# EAGLE design moddeducurrent (EAGLE 6.2)
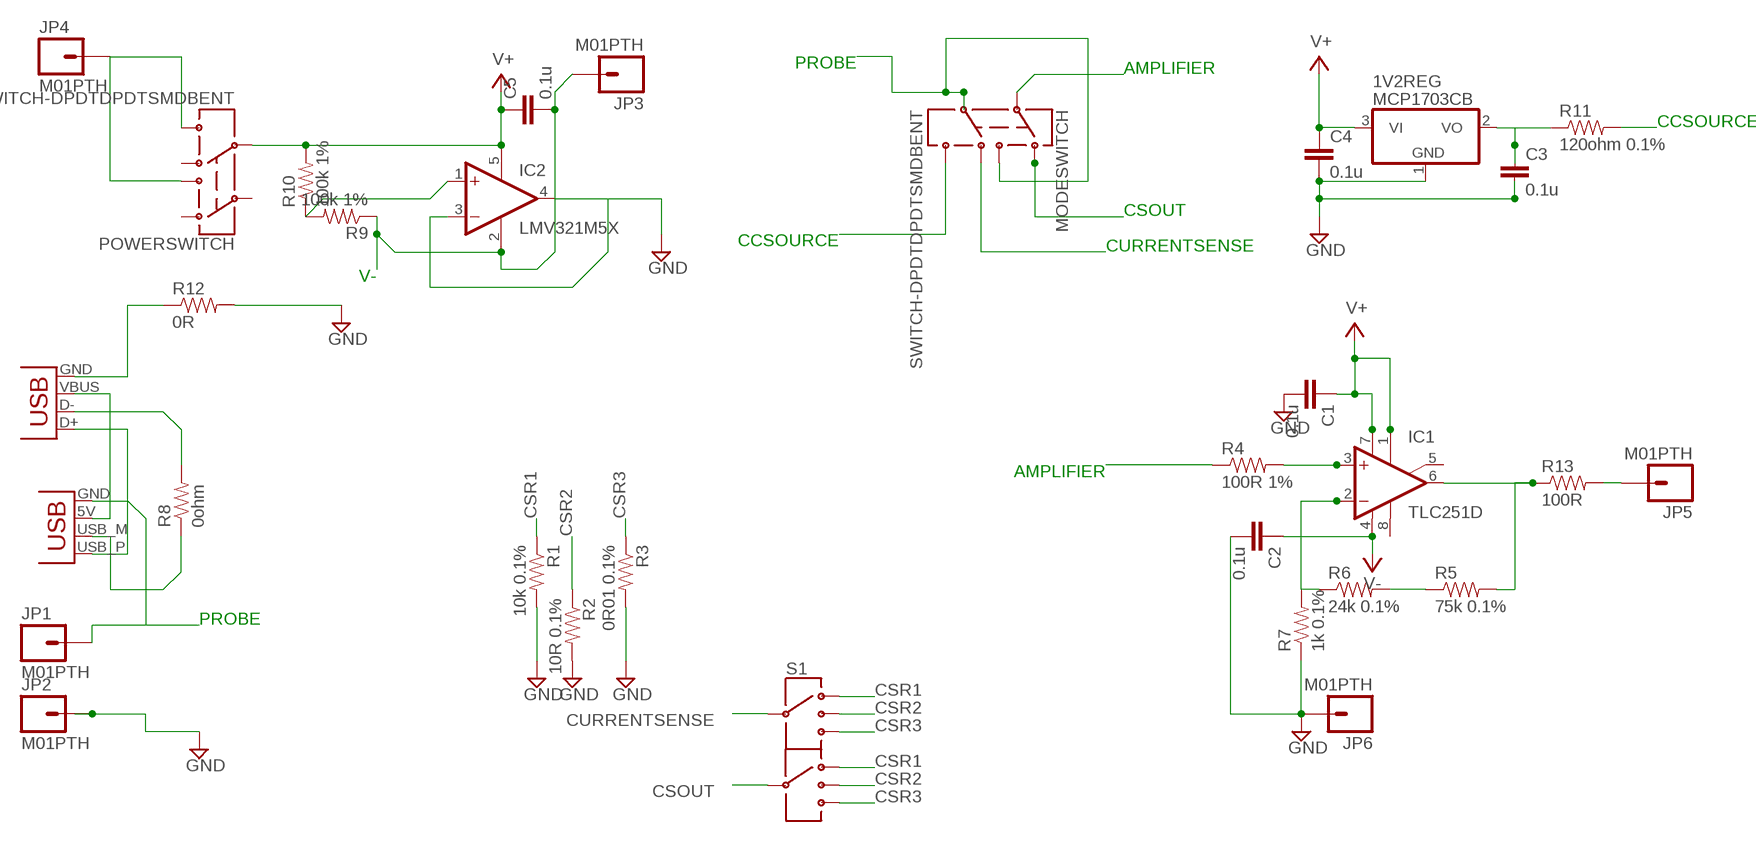
[diagram p0: schematic, sheet 1]

## Parts
1V2REG  MCP1703CB  [SOT23]
C1  0.1u  CAP0805  [0805]
C2  0.1u  CAP0805  [0805]
C3  0.1u  CAP0805  [0805]
C4  0.1u  CAP0805  [0805]
C5  0.1u  CAP0805  [0805]
IC1  TLC251D  [SO08]
IC2  LMV321M5X  [SOT23-5]
JP1  M01PTH  [1X01]
JP2  M01PTH  [1X01]
JP3  M01PTH  [1X01]
JP4  M01PTH  [1X01]
JP5  M01PTH  [1X01]
JP6  M01PTH  [1X01]
MODESWITCH  SWITCH-DPDTDPDTSMDBENT  [AYZ0202]
POWERSWITCH  SWITCH-DPDTDPDTSMDBENT  [AYZ0202]
R1  10k 0.1%  RESISTOR0805-RES  [0805]
R2  10R 0.1%  RESISTOR0805-RES  [0805]
R3  0R01 0.1%  RESISTOR0805-RES  [0805]
R4  100R 1%  RESISTOR0805-RES  [0805]
R5  75k 0.1%  RESISTOR0805-RES  [0805]
R6  24k 0.1%  RESISTOR0805-RES  [0805]
R7  1k 0.1%  RESISTOR0805-RES  [0805]
R8  0ohm  RESISTOR0805-RES  [0805]
R9  100k 1%  RESISTOR0805-RES  [0805]
R10  100k 1%  RESISTOR0805-RES  [0805]
R11  120ohm 0.1%  RESISTOR0805-RES  [0805]
R12  0R  RESISTOR0805-RES  [0805]
R13  100R  RESISTOR0805-RES  [0805]
S1  SWITCH-DP3T  [SWITCH-DP3T-SMD]
X1  USBPCB  [USB-A-PCB]
X2  USBOLD  [USB-MINIB-OLD]

## Nets
AMPIN: MODESWITCH.2 R4.1
CCSOURCE: MODESWITCH.6 R11.2
CSOUT: MODESWITCH.1 S1.BI
CSR1: R1.1 S1.A1 S1.B1
CSR2: R2.1 S1.A2 S1.B2
CSR3: R3.1 S1.A3 S1.B3
CURRENTSENSE: MODESWITCH.4 S1.AI
GND: 1V2REG.1(GND) C1.2 C2.2 C3.2 C4.2 IC2.3(-IN) IC2.4(OUT) JP2.1 JP6.1 R1.2 R2.2 R3.2 R7.1 R12.2
N$2: JP5.1 R13.2
N$4: 1V2REG.2(VO) C3.1 R11.1
N$6: R12.1 X2.GND
N$7: IC1.3(+IN) R4.2
N$8: R5.1 R6.2
N$9: IC1.2(-IN) R6.1 R7.2
N$11: R8.2 X2.D-
N$15: X1.USB_P(D+) X2.D+
N$16: R8.1 X1.USB_M(D-)
N$17: IC2.1(+IN) R9.2 R10.1
OUT: IC1.6(OUT) R5.2 R13.1
PROBE: JP1.1 MODESWITCH.3 MODESWITCH.5 X1.GND
V+: 1V2REG.3(VI) C1.1 C4.1 C5.1 IC1.1(ON1) IC1.7(V+) IC2.5(V+) POWERSWITCH.5 R10.2
V-: C2.1 C5.2 IC1.4(V-) IC2.2(V-) JP3.1 R9.1
VBAT: JP4.1 POWERSWITCH.3 POWERSWITCH.6
VUSB_EXTERN: X1.5V(VBUS) X2.VBUS
Unconnected: IC1.5(ON2) IC1.8(OPT) POWERSWITCH.1 POWERSWITCH.2 POWERSWITCH.4

## Notes on the sheet
- PROBE
- AMPLIFIER
- CCSOURCE
- CSOUT
- CCSOURCE
- CURRENTSENSE
- V-
- AMPLIFIER
- PROBE

## Library data of the parts
1V2REG = linear:MCP1703: 250 mA, 16V, Low Quiescent Current LDO Regulator Source: http://ww1.microchip.com/downloads/en/DeviceDoc/22049b.pdf
C1-C5 = SparkFun - Copy:CAP: Capacitor Standard 0603 ceramic capacitor, and 0.1" leaded capacitor.
IC1 = linear:TLC251: OP AMP
IC2 = linear:LMV321?*: General Purpose, Low Voltage, Rail-to-Rail Output Operational Amplifiers Source: http://www.national.com/mpf/LM/LMV321.html http://www.national.com/dt/lmv_qual.pdf
JP1-JP6 = SparkFun - Copy:M01: Header 1 Standard 1-pin 0.1" header. Use with straight break away headers (SKU : PRT-00116), right angle break away headers (PRT-00553), swiss pins (PRT-00743), machine pins (PRT-00117), and female headers (PRT-00115).
MODESWITCH POWERSWITCH = ebay:SWITCH-DPDT: DPDT Version of the COM-00597
R1-R13 = SparkFun - Copy:RESISTOR: Resistor Basic schematic elements and footprints for 0603, 1206, and PTH resistors.
S1 = LL:SWITCH-DP3T
X1 X2 = SparkFun - Copy:USB: USB Connectors USB-B-PTH is fully proven SKU : PRT-00139 USB-miniB is fully proven SKU : PRT-00587 USB-A-PCB is untested. USB-A-H is throughly reviewed, but untested. Spark Fun Electronics SKU : PRT-00437 USB-B-SMT is throughly reviewed, but untested. Needs silkscreen touching up. USB-A-S has not been used/tested USB-MB-H has not been used/tested

## Board
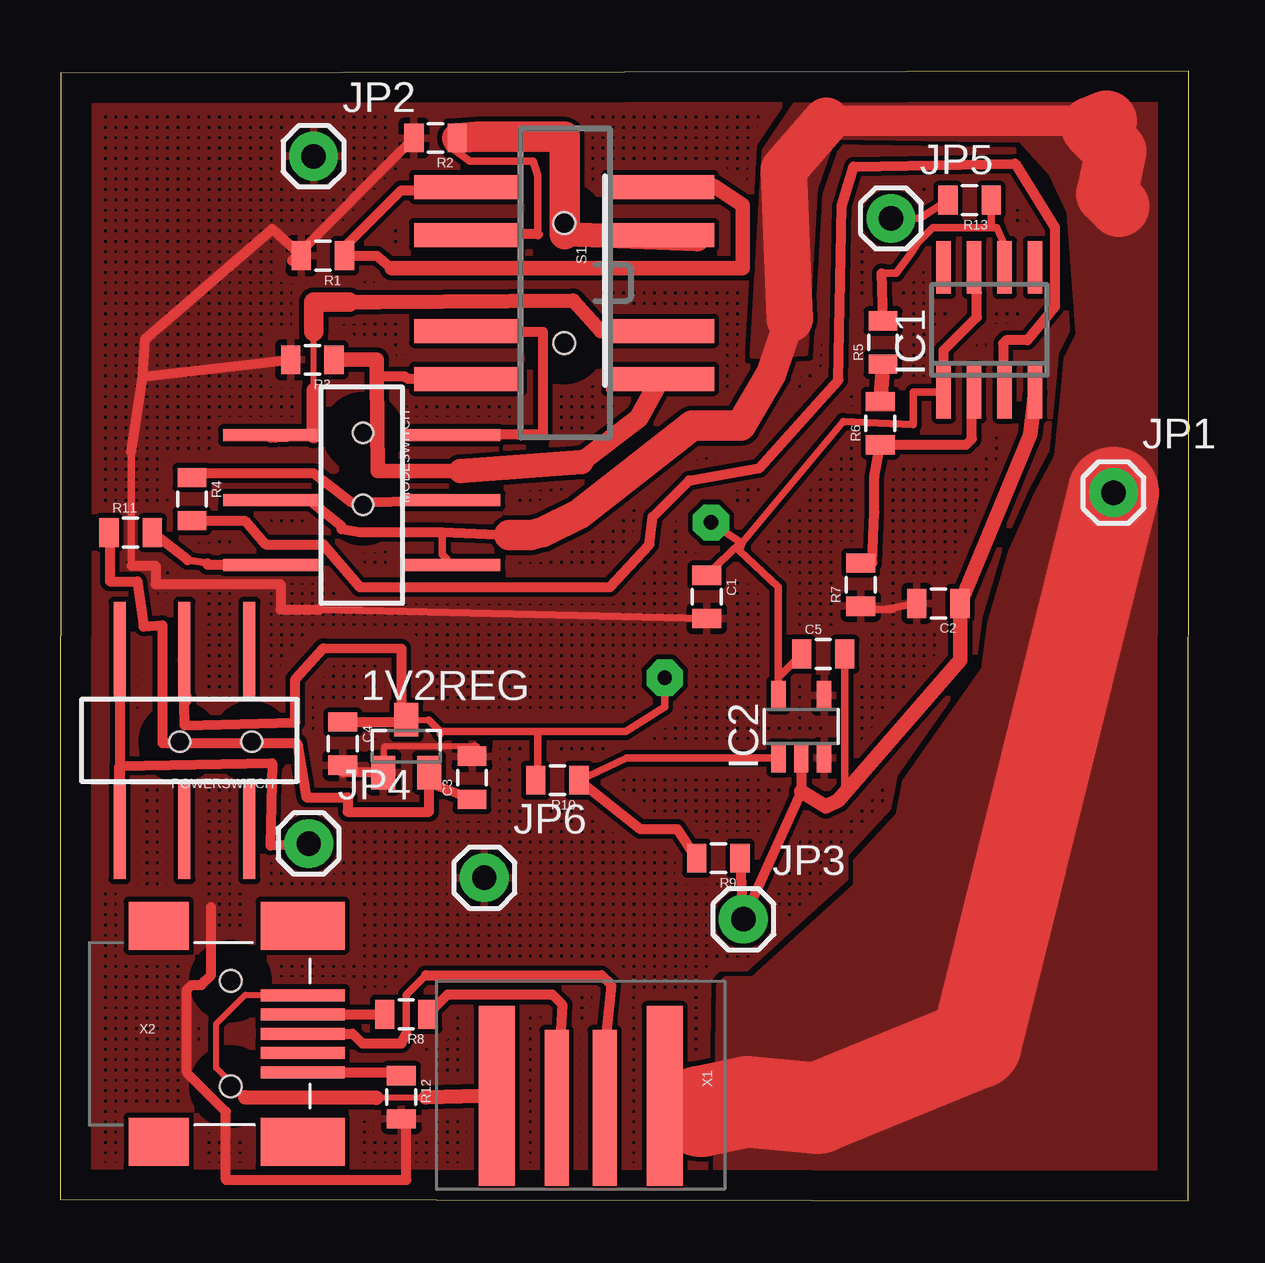
[diagram p1: board, top side]
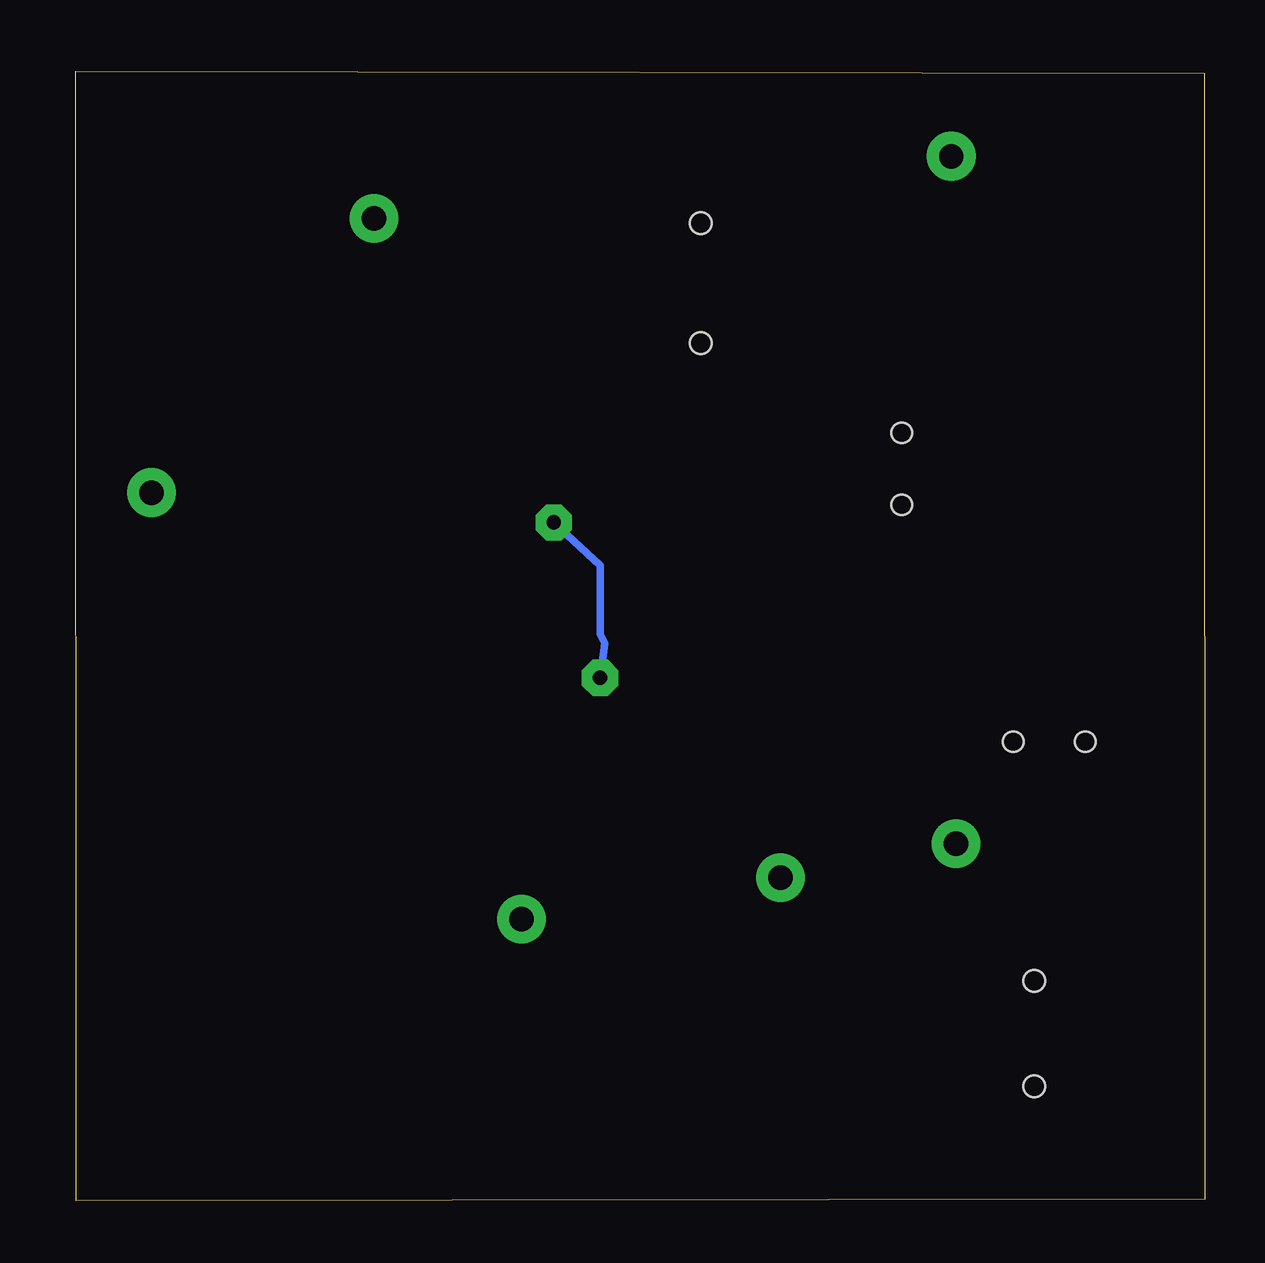
[diagram p2: board, bottom side, seen from below]

Size 47.04 x 47.08 mm. Coordinates in mm from the lower left corner, seen from the top.
Outline: 0,0.05 47.02,0 47.04,47.08 0.03,47.01 0,0.05
Copper layers (1*16): Top 0.0356mm / dielectric 1.5011mm / Bottom 0.0356mm
Design rules: minimum track width 12mil, minimum drill 21mil, track to track 8mil, track to pad 12mil, pad to pad 18mil, via to via 20mil, smd to smd 4mil, copper to edge 50mil, drill to drill 30mil, minimum pad ring 20mil, minimum via ring 18mil, stop-mask expansion 0mil, vias tented up to drill 20mil, thermal gap 10mil

### Footprints (pad centres in the part's own frame; a part is rotated, then mirrored left to right if it is on the bottom)
SOT23 = smd 1 x 1.4: 1 -0.95,-1.1; 2 0.95,-1.1; 3 0,1.1
0805 = smd 0.8 x 1.2: 1 -0.9,0; 2 0.9,0
SO08 = smd 0.6 x 2.2: 1 -1.905,-2.6; 2 -0.635,-2.6; 3 0.635,-2.6; 4 1.905,-2.6; 5 1.905,2.6; 6 0.635,2.6; 7 -0.635,2.6; 8 -1.905,2.6
SOT23-5 = smd 0.6 x 1.2: 1 -0.95,-1.306; 2 0,-1.306; 3 0.95,-1.306; 4 0.95,1.306; 5 -0.95,1.306
1X01 = drill 1.016 pad 1.88: 1 0,0
AYZ0202 = smd 0.5 x 4: 1 -1.4,3.725; 2 1.3,3.725; 3 4,3.725; 4 -1.4,-3.825; 5 1.3,-3.825; 6 4,-3.825 | hole 0.85: 1.5,0; -1.5,0
SWITCH-DP3T-SMD = smd 1 x 4.5: A1 -4,4; A2 -2,4; A3 4,4; AI 2,4; B1 -4,-4; B2 -2,-4; B3 4,-4; BI 2,-4 | hole 0.9: 2.5,0; -2.5,0
USB-A-PCB = smd 7.5 x 1.5: 5V -0.2,-3.5; GND -0.2,3.5 | smd 6.5 x 1: USB_M 0.3,-1; USB_P 0.3,1
USB-MINIB-OLD = smd 2.5 x 2: 1 -3,-4.5; 2 -3,4.5 | smd 3.5 x 2: 3 3,-4.5; 4 3,4.5 | smd 3.5 x 0.5: D+ 3,0; D- 3,0.8; GND 3,-1.6; ID 3,-0.8; VBUS 3.01,1.61 | hole 0.9: 0,2.2; 0,-2.2

### Placement (x,y rotation side)
1V2REG  14.43,18.95 0 top
C1  26.95,25.17 270 top
C2  36.6,24.9 180 top
C3  17.17,17.63 90 top
C4  11.79,19.05 270 top
C5  31.8,22.78 0 top
IC1  38.72,36.3 0 top
IC2  30.89,19.76 0 top
JP1  43.89,29.51 0 top
JP2  10.57,43.54 0 top
JP3  28.47,11.73 0 top
JP4  10.36,14.88 0 top
JP5  34.62,40.94 0 top
JP6  17.68,13.46 0 top
MODESWITCH  12.62,30.51 270 top
POWERSWITCH  6.49,19.14 180 top
R1  10.95,39.39 180 top
R2  15.65,44.3 180 top
R3  10.52,35.05 180 top
R4  5.5,29.25 270 top
R5  34.3,35.77 90 top
R6  34.18,32.41 90 top
R7  33.36,25.68 90 top
R8  14.43,7.77 180 top
R9  27.43,14.27 180 top
R10  20.73,17.53 180 top
R11  2.94,27.85 0 top
R12  14.22,4.32 270 top
R13  37.9,41.71 180 top
S1  21.01,38.25 270 top
X1  21.69,4.17 270 top
X2  7.11,6.96 0 top

### Tracks (layer width: path | path; a pad name or v marks a point on that pad's centre or on a via)
AMPIN
  Top 0.406: R4.1 6.01,30.34 7.57,30.33 10.57,30.33 12.17,29.11 MODESWITCH.2
CCSOURCE
  Top 0.305: 8.07,26.61 6.91,26.45 6.14,26.57 5.32,26.7
  Top 0.406: 5.32,26.7 R11.2 | MODESWITCH.6 6.14,26.51 6.14,26.57
CSOUT
  Top 0.406: S1.BI 17.1,36.22 20.12,36.22 20.12,31.93 16.35,31.93 MODESWITCH.1
CSR1
  Top 0.406: 13.82,38.86 13.21,39.39 R1.1 11.85,39.74 14.22,42.11 16.99,42.11 S1.B1 | 27.23,42.32 25.2,42.32 S1.A1
  Top 0.61: 13.82,38.86 28.45,38.86 28.45,41.5 27.23,42.32
CSR2
  Top 0.305: 19.91,40.28 19.91,42.72 19.71,43.33 17.07,43.33 16.26,43.94
  Top 0.406: 19.91,40.28 17.13,40.28 S1.B2 | 26.55,40.08 S1.A2 | 16.26,43.94 16.55,43.94 R2.1
  Top 1.016: 21.03,40.28 26.55,40.08
  Top 1.27: 21.03,40.28 21.03,44.35 17.36,44.35 R2.1
CSR3
  Top 0.406: S1.B3 14.49,34.25 14.4,34.34 13.2,34.34
  Top 0.61: R3.1 13.19,35.07 13.2,34.34 13.23,30.4 16.69,30.4
  Top 0.813: S1.A3 24.12,32.63 21.72,30.78
  Top 1.016: 16.69,30.4 21.72,30.78
CURRENTSENSE
  Top 0.254: 10.57,33.78 10.57,36.22
  Top 0.406: S1.AI 22.52,36.25 | 10.57,31.88 8.97,31.8 8.8,31.8 MODESWITCH.4
  Top 0.61: 22.52,36.25 21.39,37.52 13.31,37.46 12.06,37.45 | 10.57,31.88 10.57,33.78
  Top 0.813: 10.57,36.22 10.57,37.46 12.06,37.45
GND
  Top 0.254: 13.51,17.85 13.51,18.95 17.27,18.95 17.37,18.95
  Top 0.305: 10.82,24.64 C1.2 | 2.96,31.21 2.97,26.47 | 33.64,24.78 R7.1 33.5,24.64 34.7,24.64 34.43,24.65 C2.2 | 1V2REG.1 13.51,17.85 | C3.2 17.27,18.53 17.27,18.95
  Top 0.406: R2.2 9.67,39.18 R1.2 8.84,40.5 3.56,35.92 3.45,34.34 | 3.45,34.34 R3.2 | 2.97,26.47 3.99,26.47 3.99,25.7 9.19,25.7 9.19,24.64 10.82,24.64 | 2.96,31.21 3.45,34.34 | R12.2 14.43,3.42 14.43,0.86 6.91,0.86 6.91,3.71 5.28,5.33 5.28,8.79 5.49,8.99 5.89,8.99 6.3,9.4 6.3,12.24 | 1V2REG.1 11.79,17.85 C4.2
  pour Top (rank 3, hatched): -0.05,45.29 0.13,0.18 46.96,0.13 46.91,46.91 -0.1,47.12
N$2
  Top 0.305: JP5.1 35.85,40.94 R13.2
N$4
  Top 0.406: C3.1 15.38,17.41 1V2REG.2 15.38,16.2 11.99,16.2 11.99,16.81 10.26,16.81 9.88,19.08 4.27,19.08 4.27,23.99 3.48,23.93 3.23,25.82 2.08,25.82 2.08,27.61 R11.1
N$6
  Top 0.406: X2.GND 14.22,5.36 R12.1
N$7
  Top 0.406: R4.2 7.7,28.34 8.56,27.36 10.97,27.36 12.5,25.58 22.91,25.58 24.56,27.36 24.69,28.5 26.21,30.02 29.13,30.53 32.44,34.21 32.56,41.45 33.07,43.1 39.8,43.23 41.45,40.56 41.45,37.26 40.31,35.86 39.42,35.86 39.29,35.74 39.29,33.77 IC1.3
N$8
  Top 0.61: R5.1 R6.2
N$9
  Top 0.406: R7.2 33.84,26.58 33.93,28.7 33.93,30.17 R6.1 37.76,31.51 38,31.75 38,33.61 IC1.2
N$11
  Top 0.254: X2.D- 11.48,7.76
  Top 0.406: 11.48,7.76 R8.2
N$15
  Top 0.305: 14.43,6.96 14.43,8.58 15.24,9.4
  Top 0.406: X2.D+ 12.19,6.96 12.6,6.55 14.22,6.55 14.43,6.96 | 15.24,9.4 22.55,9.4 22.96,8.99 22.45,4.01 X1.USB_P
N$16
  Top 0.406: X1.USB_M 20.95,8.16 20.52,8.58 16.14,8.58 R8.1
N$17
  Top 0.305: R10.1 23.61,18.45 IC2.1
  Top 0.406: R10.1 24.18,15.49 25.72,15.49 R9.2
OUT
  Top 0.305: 34.23,38.66 34.85,38.66 35.48,39.55 35.74,39.93 36.37,40.56 38.53,40.56 | 38.53,40.56 39.04,40.56 39.42,39.67 39.42,38.96 IC1.6 | R13.1 38.8,40.57 38.53,40.56
  Top 0.406: R5.2 34.23,38.66
PROBE
  Top 0.305: 15.93,27.86 15.93,26.93 MODESWITCH.3 | X1.GND 26.09,4.37 26.72,3.73
  Top 0.406: MODESWITCH.5 10.39,29.21 11.73,28.12 11.73,27.99 12.5,27.86 15.93,27.86 18.72,27.74
  Top 1.27: 18.72,27.74 19.61,27.74 20.12,27.86 21.64,28.63 26.34,32.31 28.37,32.31 29.64,34.47 30.4,36.75 | 31.93,45.01 43.61,45.01
  Top 1.93: 30.4,36.75 30.15,42.98 31.93,45.01
  Top 2.54: 43.61,45.01 42.98,44.75 43.99,43.74 43.61,41.96 44.12,41.45
  Top 3.81: JP1.1 38.18,6.55 31.55,3.86 28.63,4.11 26.72,3.73
  pour Top (rank 2): 27.74,9.19 28.88,9.19 33.2,13.13 33.2,14.15 34.98,16.05 35.23,17.45 38.53,22.15 38.79,24.05 39.67,27.1 40.69,29.39 41.58,31.04 41.83,33.71 41.96,35.1 42.47,36.12 42.09,41.2 41.33,42.85 40.06,44.25 32.18,44.37 31.42,42.21 31.04,35.36 28.88,35.23 29.39,43.74 30.91,46.02 41.33,46.28 45.9,46.15 46.53,43.99 46.53,0.69 46.41,0.56 27.61,0.3 27.36,1.19 27.48,8.94
V+  (via drill 0.6)
  Top 0.254: 38.2,38.79 IC1.7 | 1V2REG.3 15.36,20.05 | 28.37,27.44 28.43,27.44
  Top 0.305: IC1.1 35.56,33.7 35.56,32.36 32.63,32.48 28.43,27.44 28.3,27.1 29.94,25.59 IC2.5 29.94,21.82 C5.1 | 15.36,20.05 15.85,19.56 | 15.85,19.46 15.85,19.56 | 15.85,19.56 19.91,19.56 | 19.91,19.56 19.91,17.53 R10.2 | 19.91,19.56 23.57,19.56 25.2,20.57 v25.2,21.79 | v27.13,28.27 28.37,27.44 C1.1
  Top 0.406: 5.28,20.98 5.23,20.78 POWERSWITCH.5 5.11,22.53 5.18,19.81 9.8,19.94 9.8,21.74 10.97,23.04 14.22,23.01 14.22,20.25 1V2REG.3 14.43,19.95 C4.1 | IC1.1 36.82,35.45 38.2,36.83 38.2,37.85 38.09,37.96 IC1.7
  Bottom 0.305: v25.2,21.79 24.99,23.22 25.2,23.62 25.2,26.47 v27.13,28.27
V-
  Top 0.305: C5.2 32.7,17.08 32.44,16.69
  Top 0.406: R9.1 JP3.1 30.89,17.07 IC2.2
  Top 0.61: IC1.4 40.44,31.93 C2.1 37.52,22.78 37.52,22.53 32.44,16.69 31.9,16.43 30.89,17.07
VBAT
  Top 0.406: POWERSWITCH.6 POWERSWITCH.3 2.48,18.12 8.84,18.24 8.76,14.81 JP4.1
VUSB_EXTERN
  Top 0.254: 8.74,8.58 7.72,8.58 6.5,7.37 6.5,5.54 7.72,4.32 | 17.52,4.37 X1.5V | 13.18,4.29 13.31,4.32 15.24,4.32
  Top 0.406: X2.VBUS 9.57,8.57 9.55,8.58 8.74,8.58
  Top 0.61: 15.24,4.32 17.52,4.37 | 7.72,4.32 13.18,4.29